# EAGLE design ADC_DSP_DIFF (EAGLE 7.4.0)
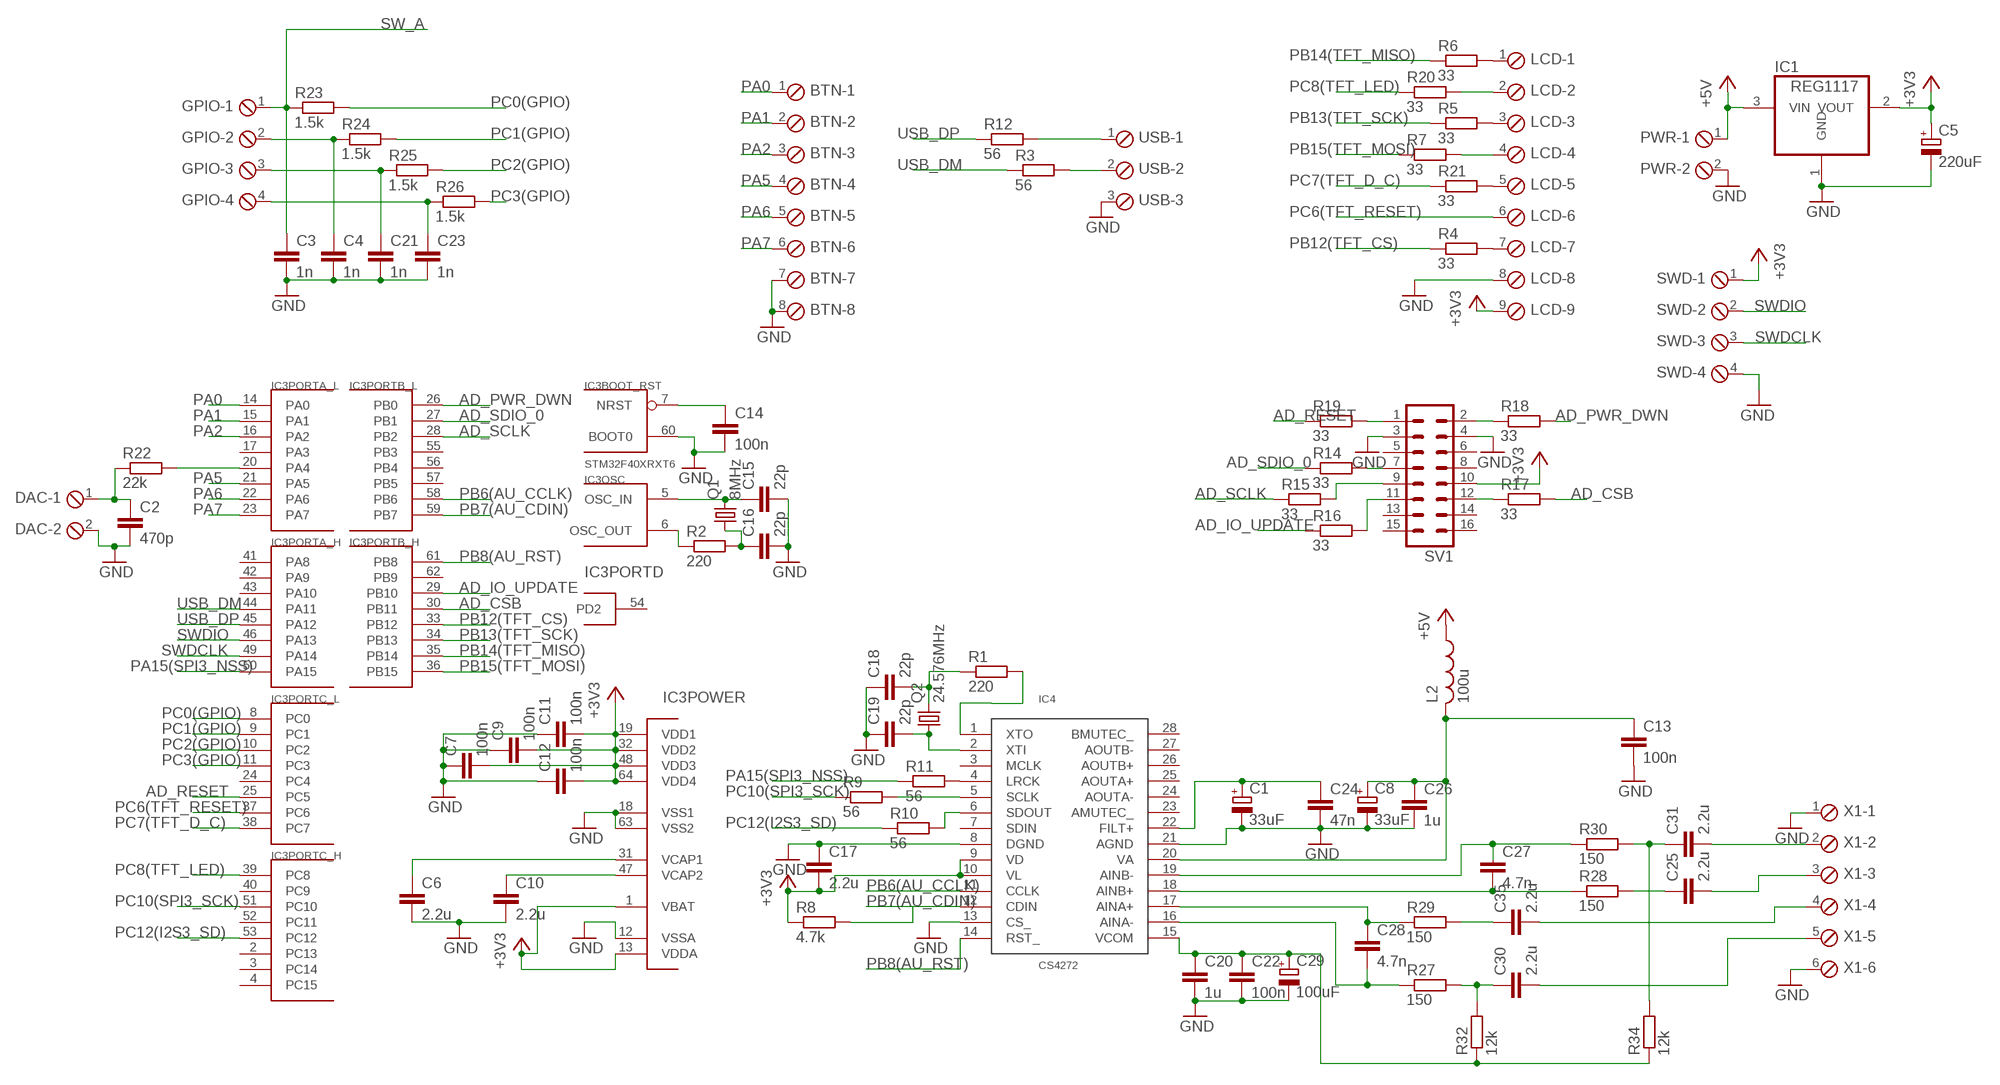
[diagram p0: schematic, sheet 1]

## Parts
BTN  MPT8  [8POL254]
C1  33uF  CPOL-EU153CLV-0605  [153CLV-0605]
C2  470p  C-EUC0805  [C0805]
C3  1n  C-EUC0805  [C0805]
C4  1n  C-EUC0805  [C0805]
C5  220uF  CPOL-EU153CLV-0605  [153CLV-0605]
C6  2.2u  C-EUC0603  [C0603]
C7  100n  C-EUC0603  [C0603]
C8  33uF  CPOL-EU153CLV-0605  [153CLV-0605]
C9  100n  C-EUC0603  [C0603]
C10  2.2u  C-EUC0603  [C0603]
C11  100n  C-EUC0603  [C0603]
C12  100n  C-EUC0603  [C0603]
C13  100n  C-EUC0603  [C0603]
C14  100n  C-EUC0603  [C0603]
C15  22p  C-EUC0603  [C0603]
C16  22p  C-EUC0603  [C0603]
C17  2.2u  C-EUC0603  [C0603]
C18  22p  C-EUC0603  [C0603]
C19  22p  C-EUC0603  [C0603]
C20  1u  C-EUC0603  [C0603]
C21  1n  C-EUC0805  [C0805]
C22  100n  C-EUC0603  [C0603]
C23  1n  C-EUC0805  [C0805]
C24  47n  C-EUC0805  [C0805]
C25  2.2u  C-EUC0805  [C0805]
C26  1u  C-EUC0603  [C0603]
C27  4.7n  C-EUC0805  [C0805]
C28  4.7n  C-EUC0805  [C0805]
C29  100uF  CPOL-EU153CLV-0605  [153CLV-0605]
C30  2.2u  C-EUC0805  [C0805]
C31  2.2u  C-EUC0805  [C0805]
C35  2.2u  C-EUC0805  [C0805]
DAC  MPT2  [2POL254]
GPIO  MPT4  [4POL254]
IC1  REG1117  [SOT223]
IC3  STM32F40XRXT6  [TQFP64]
IC4  CS4272  [TSSOP28]
L2  100u  L-US0207/12  [0207/12]
LCD  MPT9  [9POL254]
PWR  MPT2  [2POL254]
Q1  8MHz  CRYSTALHC49S  [HC49/S]
Q2  24.576MHz  CRYSTALHC49S  [HC49/S]
R1  220  R-EU_R0603  [R0603]
R2  220  R-EU_R0603  [R0603]
R3  56  R-EU_R0603  [R0603]
R4  33  R-EU_R0603  [R0603]
R5  33  R-EU_R0603  [R0603]
R6  33  R-EU_R0603  [R0603]
R7  33  R-EU_R0603  [R0603]
R8  4.7k  R-EU_R0603  [R0603]
R9  56  R-EU_R0603  [R0603]
R10  56  R-EU_R0603  [R0603]
R11  56  R-EU_R0603  [R0603]
R12  56  R-EU_R0603  [R0603]
R14  33  R-EU_R0603  [R0603]
R15  33  R-EU_R0603  [R0603]
R16  33  R-EU_R0603  [R0603]
R17  33  R-EU_R0603  [R0603]
R18  33  R-EU_R0603  [R0603]
R19  33  R-EU_R0603  [R0603]
R20  33  R-EU_R0603  [R0603]
R21  33  R-EU_R0603  [R0603]
R22  22k  R-EU_R0603  [R0603]
R23  1.5k  R-EU_R0603  [R0603]
R24  1.5k  R-EU_R0603  [R0603]
R25  1.5k  R-EU_R0603  [R0603]
R26  1.5k  R-EU_R0603  [R0603]
R27  150  R-EU_R0603  [R0603]
R28  150  R-EU_R0603  [R0603]
R29  150  R-EU_R0603  [R0603]
R30  150  R-EU_R0603  [R0603]
R32  12k  R-EU_R0603  [R0603]
R34  12k  R-EU_R0603  [R0603]
SV1  ML16  [ML16]
SWD  MPT4  [4POL254]
USB  MPT3  [3POL254]
X1  MPT6  [6POL254]

## Nets
4052_B: C4.1 GPIO.2 R24.1
+3V3: C5.+ C7.2 C9.2 C11.2 C12.2 C17.2 IC1.2(VOUT) IC3.1(POWER:VBAT) IC3.13(POWER:VDDA) IC3.19(POWER:VDD1) IC3.32(POWER:VDD2) IC3.48(POWER:VDD3) IC3.64(POWER:VDD4) IC4.9(VD) IC4.10(VL) LCD.9 R8.1 SV1.10 SWD.1
+5V: IC1.3(VIN) L2.1 PWR.1
AD_CSB: IC3.30(PORTB_H:PB11) R17.2
AD_IO_UPDATE: IC3.29(PORTB_H:PB10) R16.1
AD_PWR_DWN: IC3.26(PORTB_L:PB0) R18.2
AD_RESET: IC3.25(PORTC_L:PC5) R19.1
AD_SCLK: IC3.28(PORTB_L:PB2) R15.1
AD_SDIO_0: IC3.27(PORTB_L:PB1) R14.1
AINB+: C27.2 IC4.18(AINB+) R28.1
AVCC: C8.+ C13.1 C26.1 IC4.20(VA) L2.2
D+: R12.2 USB.1
D-: R3.2 USB.2
GND: BTN.7 BTN.8 C1.- C2.2 C3.2 C4.2 C5.- C6.2 C7.1 C8.- C9.1 C10.2 C11.1 C12.1 C13.2 C14.2 C15.2 C16.2 C17.1 C18.1 C19.1 C20.2 C21.2 C22.2 C23.2 C24.2 C26.2 C29.- DAC.2 IC1.1(GND) IC3.12(POWER:VSSA) IC3.18(POWER:VSS1) IC3.60(BOOT_RST:BOOT0) IC3.63(POWER:VSS2) IC4.8(DGND) IC4.13(CS_) IC4.21(AGND) LCD.8 PWR.2 SV1.3 SV1.4 SWD.4 USB.3 X1.1 X1.6
N$1: C10.1 IC3.47(POWER:VCAP2)
N$2: C6.1 IC3.31(POWER:VCAP1)
N$3: R16.2 SV1.11
N$4: C14.1 IC3.7(BOOT_RST:NRST)
N$5: C15.1 IC3.5(OSC:OSC_IN) Q1.2
N$6: C16.1 Q1.1 R2.2
N$7: C19.2 IC4.2(XTI) Q2.1
N$8: C18.2 Q2.2 R1.1
N$9: IC4.4(LRCK) R11.2
N$10: IC4.5(SCLK) R9.2
N$11: IC4.6(SDOUT) R10.2
N$12: C1.+ C24.1 IC4.22(FILT+)
N$13: C27.1 IC4.19(AINB-) R30.1
N$14: R14.2 SV1.7
N$15: C35.2 X1.4
N$16: R19.2 SV1.1
N$17: IC4.1(XTO) R1.2
N$18: C28.1 IC4.17(AINA+) R29.1
N$19: IC3.6(OSC:OSC_OUT) R2.1
N$20: LCD.1 R6.2
N$21: LCD.3 R5.2
N$22: LCD.2 R20.2
N$23: R15.2 SV1.9
N$24: LCD.4 R7.2
N$26: C28.2 IC4.16(AINA-) R27.1
N$29: R18.1 SV1.2
N$30: C31.1 R30.2 R34.2
N$31: R17.1 SV1.12
N$34: LCD.7 R4.2
N$35: LCD.5 R21.2
N$36: IC3.20(PORTA_L:PA4) R22.2
N$37: C2.1 DAC.1 R22.1
N$38: C30.1 R27.2 R32.2
N$39: C25.1 R28.2
N$40: C21.1 GPIO.3 R25.1
N$41: C23.1 GPIO.4 R26.1
N$49: C31.2 X1.2
N$50: C35.1 R29.2
N$51: C25.2 X1.3
N$52: C30.2 X1.5
PA0: BTN.1 IC3.14(PORTA_L:PA0)
PA1: BTN.2 IC3.15(PORTA_L:PA1)
PA2: BTN.3 IC3.16(PORTA_L:PA2)
PA5: BTN.4 IC3.21(PORTA_L:PA5)
PA6: BTN.5 IC3.22(PORTA_L:PA6)
PA7: BTN.6 IC3.23(PORTA_L:PA7)
PA15(SPI3_NSS): IC3.50(PORTA_H:PA15) R11.1
PB6(AU_CCLK): IC3.58(PORTB_L:PB6) IC4.11(CCLK)
PB7(AU_CDIN): IC3.59(PORTB_L:PB7) IC4.12(CDIN) R8.2
PB8(AU_RST): IC3.61(PORTB_H:PB8) IC4.14(RST_)
PB12(TFT_CS): IC3.33(PORTB_H:PB12) R4.1
PB13(TFT_SCK): IC3.34(PORTB_H:PB13) R5.1
PB14(TFT_MISO): IC3.35(PORTB_H:PB14) R6.1
PB15(TFT_MOSI): IC3.36(PORTB_H:PB15) R7.1
PC0(GPIO): IC3.8(PORTC_L:PC0) R23.2
PC1(GPIO): IC3.9(PORTC_L:PC1) R24.2
PC2(GPIO): IC3.10(PORTC_L:PC2) R25.2
PC3(GPIO): IC3.11(PORTC_L:PC3) R26.2
PC6(TFT_RESET): IC3.37(PORTC_L:PC6) LCD.6
PC7(TFT_D_C): IC3.38(PORTC_L:PC7) R21.1
PC8(TFT_LED): IC3.39(PORTC_H:PC8) R20.1
PC10(SPI3_SCK): IC3.51(PORTC_H:PC10) R9.1
PC12(I2S3_SD): IC3.53(PORTC_H:PC12) R10.1
SW_A: C3.1 GPIO.1 R23.1
SWDCLK: IC3.49(PORTA_H:PA14) SWD.3
SWDIO: IC3.46(PORTA_H:PA13) SWD.2
USB_DM: IC3.44(PORTA_H:PA11) R3.1
USB_DP: IC3.45(PORTA_H:PA12) R12.1
VCOM: C20.1 C22.1 C29.+ IC4.15(VCOM) R32.1 R34.1
Unconnected: IC3.2(PORTC_H:PC13) IC3.3(PORTC_H:PC14) IC3.4(PORTC_H:PC15) IC3.17(PORTA_L:PA3) IC3.24(PORTC_L:PC4) IC3.40(PORTC_H:PC9) IC3.41(PORTA_H:PA8) IC3.42(PORTA_H:PA9) IC3.43(PORTA_H:PA10) IC3.52(PORTC_H:PC11) IC3.54(PORTD:PD2) IC3.55(PORTB_L:PB3) IC3.56(PORTB_L:PB4) IC3.57(PORTB_L:PB5) IC3.62(PORTB_H:PB9) IC4.3(MCLK) IC4.7(SDIN) IC4.23(AMUTEC_) IC4.24(AOUTA-) IC4.25(AOUTA+) IC4.26(AOUTB+) IC4.27(AOUTB-) IC4.28(BMUTEC_) SV1.5 SV1.6 SV1.8 SV1.13 SV1.14 SV1.15 SV1.16

## Library data of the parts
BTN = con-phoenix-254:MPT8: PHOENIX CONNECTOR; OC_FARNELL: unknown; OC_NEWARK: unknown
C1 C5 C8 C29 = rcl:CPOL-EU: POLARIZED CAPACITOR, European symbol
C2-C4 C6 C7 C9-C28 C30 C31 C35 = rcl:C-EU: CAPACITOR, European symbol
DAC PWR = con-phoenix-254:MPT2: PHOENIX CONNECTOR; OC_FARNELL: unknown; OC_NEWARK: unknown
GPIO SWD = con-phoenix-254:MPT4: PHOENIX CONNECTOR; OC_FARNELL: unknown; OC_NEWARK: unknown
IC1 = burr-brown:REG1117: 800mA and 1A Low Dropout (LDO) Positive Regulator 1.8V, 2.5V, 2.85V, 3.3V, 5V, and Adj; MPN: REG1117; OC_FARNELL: 1097566; OC_NEWARK: 14P6981
IC3 = stm32:STM32F40XRXT6: STM32F40X LQFP64
IC4 = balmer:CS4272: 24-Bit, 192 kHz Stereo Audio CODEC
L2 = rcl:L-US: INDUCTOR, American symbol
LCD = con-phoenix-254:MPT9: PHOENIX CONNECTOR; OC_FARNELL: unknown; OC_NEWARK: unknown
Q1 Q2 = crystal:CRYSTAL: CRYSTAL; OC_FARNELL: 1667008; OC_NEWARK: unknown
R1-R12 R14-R30 R32 R34 = rcl:R-EU_: RESISTOR, European symbol
SV1 = con-harting-ml:ML16: HARTING; OC_FARNELL: unknown; OC_NEWARK: unknown
USB = con-phoenix-254:MPT3: PHOENIX CONNECTOR; OC_FARNELL: unknown; OC_NEWARK: unknown
X1 = con-phoenix-254:MPT6: PHOENIX CONNECTOR; OC_FARNELL: unknown; OC_NEWARK: unknown

## Board
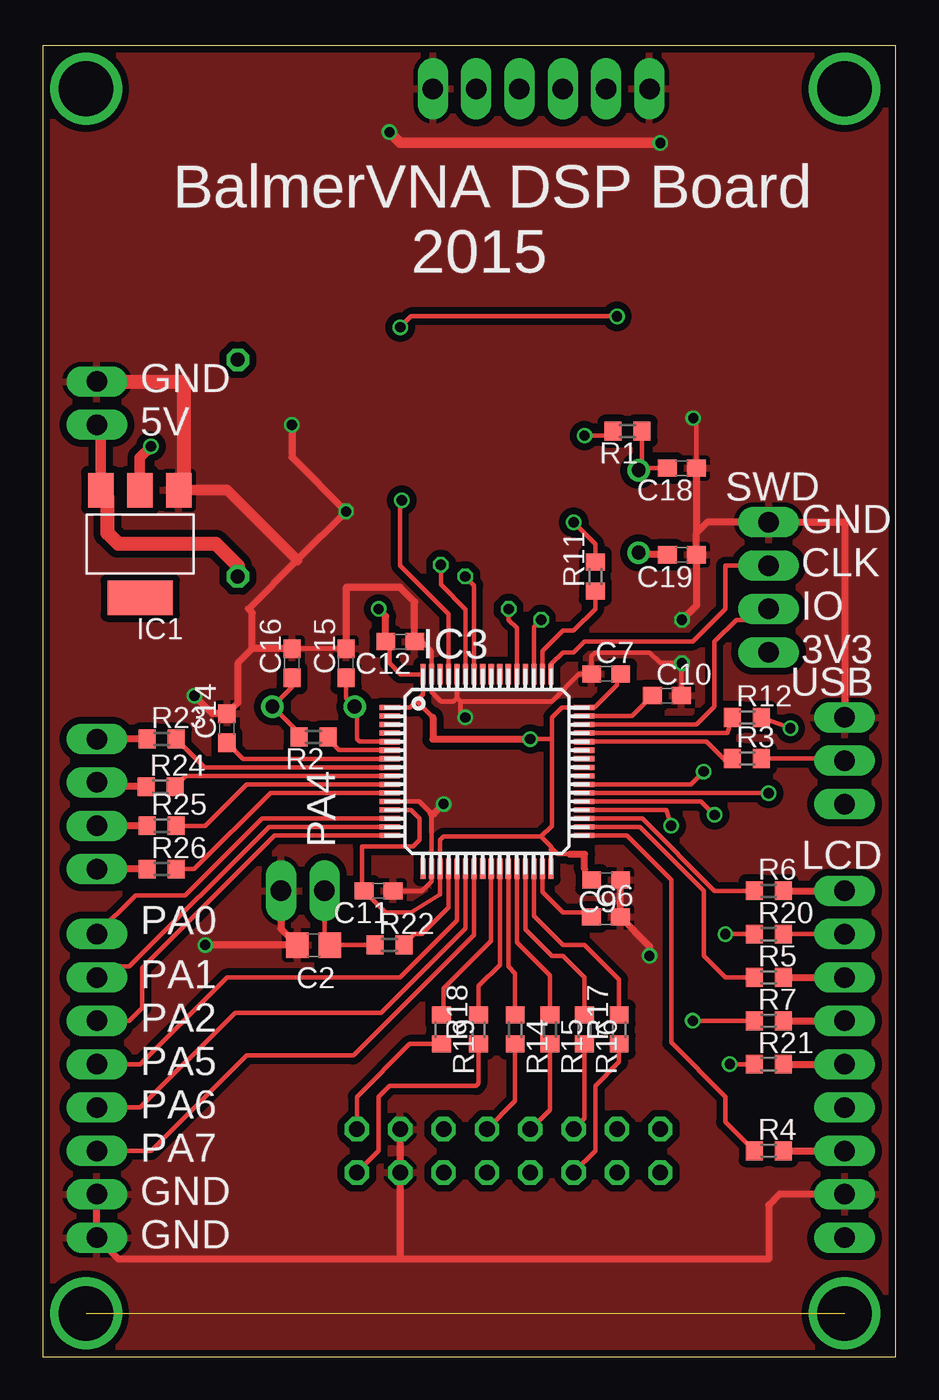
[diagram p1: board, top side]
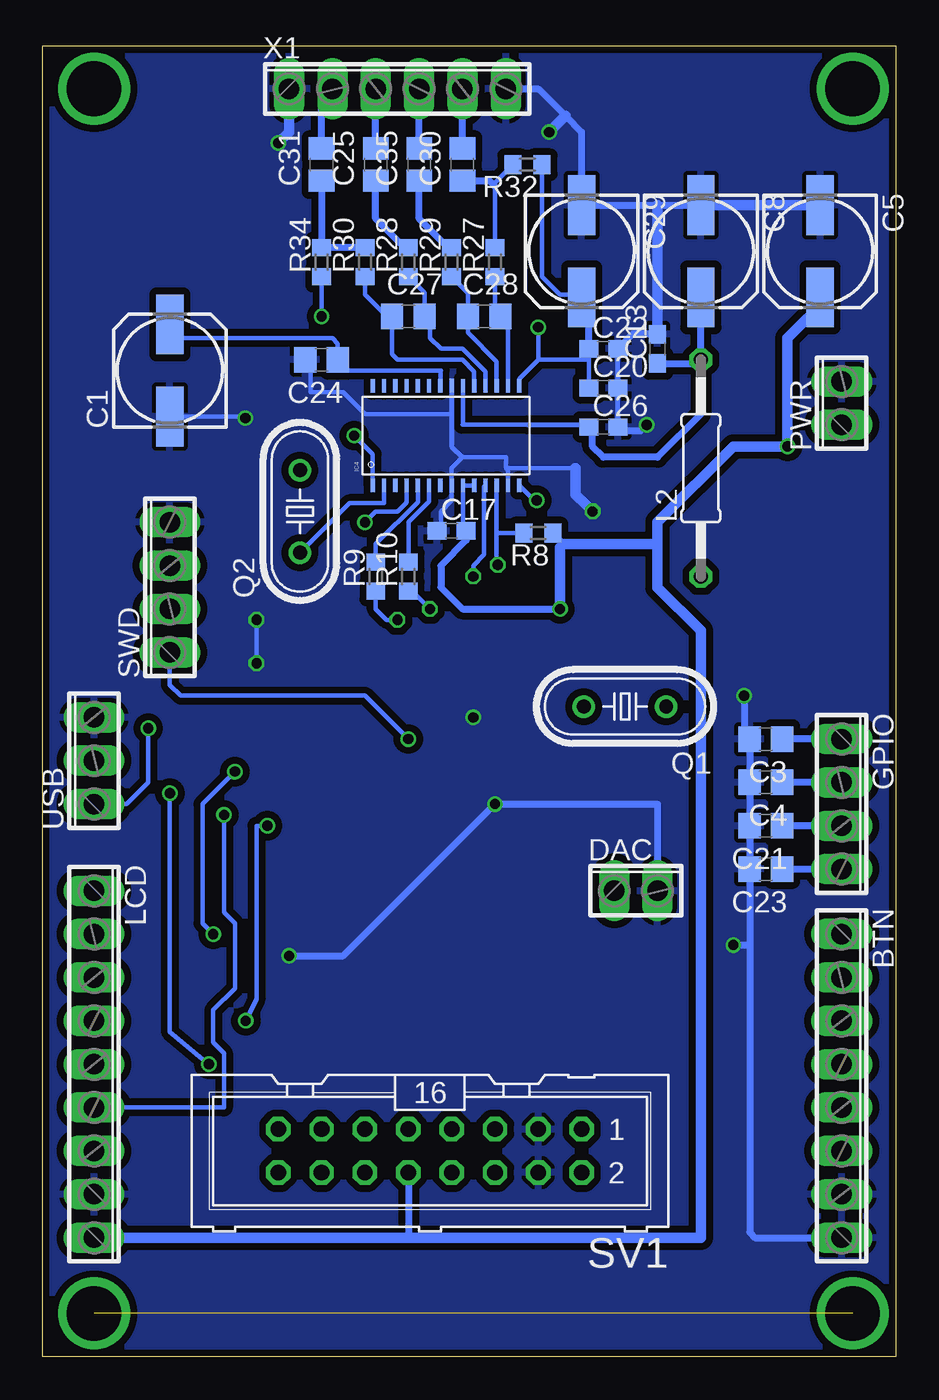
[diagram p2: board, bottom side, seen from below]

Size 50 x 76.83 mm. Coordinates in mm from the lower left corner, seen from the top.
Outline: 0,0 50,0 50,76.83 0,76.83 0,0
Copper layers (1*16): Top 0.035mm / dielectric 1.5mm / Bottom 0.035mm
Design rules "ITEADstudio_DRC": minimum track width 6mil, minimum drill 12mil, track to track 6mil, track to pad 6mil, pad to pad 6mil, via to via 6mil, smd to smd 0mil, copper to edge 10mil, drill to drill 10mil, minimum pad ring 10mil, minimum via ring 6mil, stop-mask expansion 2mil, vias tented up to drill 100mil, thermal gap 10mil

### Footprints (pad centres in the part's own frame; a part is rotated, then mirrored left to right if it is on the bottom)
8POL254 = drill 1.2 long: 1 -8.89,0; 2 -6.35,0; 3 -3.81,0; 4 -1.27,0; 5 1.27,0; 6 3.81,0; 7 6.35,0; 8 8.89,0
153CLV-0605 = smd 3.5 x 1.6: + 2.7,0; - -2.7,0
C0805 = smd 1.3 x 1.5: 1 -0.95,0; 2 0.95,0
C0603 = smd 1.1 x 1: 1 -0.85,0; 2 0.85,0
2POL254 = drill 1.2 long: 1 -1.27,0; 2 1.27,0
4POL254 = drill 1.2 long: 1 -3.81,0; 2 -1.27,0; 3 1.27,0; 4 3.81,0
SOT223 = smd 1.499 x 2.007: 1 -2.261,-3.15; 2 0.025,-3.15; 3 2.311,-3.15 | smd 3.81 x 2.007: 4 0,3.15
TQFP64 = smd 1.2 x 0.3: 1 -5.7,3.75; 2 -5.7,3.25; 3 -5.7,2.75; 4 -5.7,2.25; 5 -5.7,1.75; 6 -5.7,1.25; 7 -5.7,0.75; 8 -5.7,0.25; 9 -5.7,-0.25; 10 -5.7,-0.75; 11 -5.7,-1.25; 12 -5.7,-1.75; 13 -5.7,-2.25; 14 -5.7,-2.75; 15 -5.7,-3.25; 16 -5.7,-3.75; 33 5.7,-3.75; 34 5.7,-3.25; 35 5.7,-2.75; 36 5.7,-2.25; 37 5.7,-1.75; 38 5.7,-1.25; 39 5.7,-0.75; 40 5.7,-0.25; 41 5.7,0.25; 42 5.7,0.75; 43 5.7,1.25; 44 5.7,1.75; 45 5.7,2.25; 46 5.7,2.75; 47 5.7,3.25; 48 5.7,3.75 | smd 0.3 x 1.2: 17 -3.75,-5.7; 18 -3.25,-5.7; 19 -2.75,-5.7; 20 -2.25,-5.7; 21 -1.75,-5.7; 22 -1.25,-5.7; 23 -0.75,-5.7; 24 -0.25,-5.7; 25 0.25,-5.7; 26 0.75,-5.7; 27 1.25,-5.7; 28 1.75,-5.7; 29 2.25,-5.7; 30 2.75,-5.7; 31 3.25,-5.7; 32 3.75,-5.7; 49 3.75,5.7; 50 3.25,5.7; 51 2.75,5.7; 52 2.25,5.7; 53 1.75,5.7; 54 1.25,5.7; 55 0.75,5.7; 56 0.25,5.7; 57 -0.25,5.7; 58 -0.75,5.7; 59 -1.25,5.7; 60 -1.75,5.7; 61 -2.25,5.7; 62 -2.75,5.7; 63 -3.25,5.7; 64 -3.75,5.7
TSSOP28 = smd 0.8 x 0.25: 1 -2.921,4.623; 2 -2.921,3.962; 3 -2.921,3.302; 4 -2.921,2.642; 5 -2.921,1.981; 6 -2.921,1.321; 7 -2.921,0.66; 8 -2.927,0; 9 -2.921,-0.66; 10 -2.921,-1.321; 11 -2.921,-1.981; 12 -2.921,-2.642; 13 -2.921,-3.302; 14 -2.921,-3.962; 15 2.921,-3.962; 16 2.921,-3.302; 17 2.921,-2.642; 18 2.921,-1.981; 19 2.921,-1.321; 20 2.921,-0.66; 21 2.927,0; 22 2.921,0.66; 23 2.921,1.321; 24 2.921,1.981; 25 2.921,2.642; 26 2.921,3.302; 27 2.921,3.962; 28 2.921,4.623
0207/12 = drill 0.813 octagon: 1 -6.35,0; 2 6.35,0
9POL254 = drill 1.2 long: 1 -10.16,0; 2 -7.62,0; 3 -5.08,0; 4 -2.54,0; 5 0,0; 6 2.54,0; 7 5.08,0; 8 7.62,0; 9 10.16,0
HC49/S = drill 0.813: 1 -2.413,0; 2 2.413,0
R0603 = smd 1 x 1.1: 1 -0.85,0; 2 0.85,0
ML16 = drill 0.914 octagon: 1 -8.89,-1.27; 2 -8.89,1.27; 3 -6.35,-1.27; 4 -6.35,1.27; 5 -3.81,-1.27; 6 -3.81,1.27; 7 -1.27,-1.27; 8 -1.27,1.27; 9 1.27,-1.27; 10 1.27,1.27; 11 3.81,-1.27; 12 3.81,1.27; 13 6.35,-1.27; 14 6.35,1.27; 15 8.89,-1.27; 16 8.89,1.27
3POL254 = drill 1.2 long: 1 -2.54,0; 2 0,0; 3 2.54,0
6POL254 = drill 1.2 pad 1.778 long: 1 -6.35,0; 2 -3.81,0; 3 -1.27,0; 4 1.27,0; 5 3.81,0; 6 6.35,0

### Placement (x,y rotation side)
BTN  3.17,15.88 270 bottom
C1  42.55,57.78 90 bottom
C2  15.88,24.13 180 top
C3  7.62,36.2 180 bottom
C4  7.62,33.66 180 bottom
C5  4.45,64.77 270 bottom
C6  33,25.77 0 top
C7  33.02,40.01 0 top
C8  11.43,64.77 270 bottom
C9  33.02,27.94 180 top
C10  36.58,38.73 0 top
C11  19.68,27.3 180 top
C12  20.95,41.91 180 top
C13  13.97,59.05 90 bottom
C14  10.79,36.83 90 top
C15  17.78,40.64 90 top
C16  14.61,40.64 90 top
C17  26.04,48.4 0 bottom
C18  37.47,52.07 180 top
C19  37.47,46.99 180 top
C20  17.14,56.77 0 bottom
C21  7.62,31.11 180 bottom
C22  17.14,59.05 0 bottom
C23  7.62,28.57 180 bottom
C24  33.66,58.42 180 bottom
C25  30.48,69.85 90 bottom
C26  17.14,54.48 0 bottom
C27  28.57,60.96 0 bottom
C28  24.13,60.96 0 bottom
C29  18.41,64.77 270 bottom
C30  25.4,69.85 90 bottom
C31  33.66,69.85 90 bottom
C35  27.94,69.85 90 bottom
DAC  15.24,27.3 0 bottom
GPIO  3.17,32.38 270 bottom
IC1  5.71,47.62 180 top
IC3  26.04,34.29 0 top
IC4  26.04,53.98 90 bottom
L2  11.43,52.07 90 bottom
LCD  46.99,17.14 270 bottom
PWR  3.17,55.88 90 bottom
Q1  15.88,38.1 180 bottom
Q2  34.92,49.53 90 bottom
R1  34.27,54.23 180 top
R2  15.88,36.32 180 top
R3  41.27,35.06 0 top
R4  42.55,12.06 0 top
R5  42.55,22.23 0 top
R6  42.55,27.3 0 top
R7  42.55,19.68 0 top
R8  20.95,48.26 180 bottom
R9  30.48,45.72 90 bottom
R10  28.57,45.72 90 bottom
R11  32.38,45.72 90 top
R12  41.27,37.47 0 top
R14  27.69,19.18 270 top
R15  29.72,19.18 270 top
R16  31.75,19.18 270 top
R17  33.78,19.18 90 top
R18  25.54,19.18 90 top
R19  23.38,19.18 270 top
R20  42.55,24.77 0 top
R21  42.55,17.14 0 top
R22  20.32,24.13 0 top
R23  6.99,36.2 0 top
R24  6.91,33.41 0 top
R25  6.99,31.11 0 top
R26  6.99,28.57 0 top
R27  23.5,64.14 90 bottom
R28  28.57,64.14 90 bottom
R29  26.04,64.14 90 bottom
R30  31.11,64.14 90 bottom
R32  21.59,69.85 180 bottom
R34  33.66,64.14 90 bottom
SV1  27.3,12.06 180 bottom
SWD  42.55,45.09 90 bottom
USB  46.99,34.92 90 bottom
X1  29.21,74.3 0 bottom

### Tracks (layer width: path | path; a pad name or v marks a point on that pad's centre or on a via)
4052_B
  Top 0.406: R24.1 3.42,33.41 GPIO.2
  Bottom 0.406: GPIO.2 C4.1
+3V3  (via drill 0.6)
  Top 0.25: 29.21,30.48 23.5,30.48 23.29,30.27 IC3.19 23.29,27.09 21.59,26.04 20.11,26.04 C11.2 | IC3.32 29.79,29.84 | 29.79,29.84 29.79,29.91 29.21,30.48 | 29.84,36.2 29.84,37.47 30.42,38.04 IC3.48 32.33,38.04 33.66,39.37 33.66,39.79 C7.2 | 29.84,36.2 29.84,31.11 29.21,30.48 | C12.2 20.32,41.7 20.32,40.64 20.97,39.99 IC3.64 22.29,38.8 21.91,38.42 | IC3.1 21.53,38.04 21.91,38.42 | 22.86,37.47 21.91,38.42 | 29.79,29.84 30.18,29.45 30.88,29.45 | 31.75,28.57 31.75,28.36 C9.2 | IC3.13 21.58,32.04 22.09,31.53 22.09,30.28 21.71,29.91 18.71,29.91 18.71,27.43 C11.2 | 19.05,27.52 C11.2 | v28.57,36.2 29.84,36.2
  Top 0.406: 30.88,29.45 31.75,29.45 31.75,28.57 | C12.2 20.11,43.4 v19.68,43.81 | 22.86,37.47 22.86,36.2 v28.57,36.2
  Top 0.61: IC1.2 5.69,52.68 v6.35,53.34
  Bottom 0.25: IC4.10 IC4.9 25.38,48.59 C17.2 | SWD.1 42.55,39.37 41.91,38.73 31.11,38.73 v28.57,36.2
  Bottom 0.406: R8.1 19.47,47.62 19.68,47.41 | C17.2 25.18,47.84 26.67,46.35 26.67,45.09 25.4,43.81 v19.68,43.81 | SV1.10 28.57,6.99
  Bottom 0.61: v19.68,43.81 19.68,47.41 | 13.97,47.62 19.47,47.62 | C5.+ 3.97,62.07 6.35,59.69 v6.35,53.34 9.53,53.34 13.97,48.9 13.97,47.62 | LCD.9 28.57,6.99 11.43,6.99 11.43,42.55 13.97,45.09 13.97,47.62
+5V
  Top 0.61: IC1.3 3.4,54.38 PWR.1
  Top 0.813: L2.1 11.43,46.35 10.16,47.62 4.45,47.62 3.81,48.26 3.81,50.37 IC1.3
AD_CSB
  Top 0.25: IC3.30 28.79,25.82 30.48,24.13 31.75,24.13 33.78,22.1 R17.2
AD_IO_UPDATE
  Top 0.25: IC3.29 28.29,25.05 29.84,23.5 30.48,23.5 31.75,22.23 R16.1
AD_PWR_DWN
  Top 0.25: IC3.26 26.79,22.98 25.54,21.73 R18.2
AD_RESET
  Top 0.25: IC3.25 26.29,24.38 23.5,21.59 23.5,20.14 R19.1
AD_SCLK
  Top 0.25: IC3.28 27.79,24.29 29.72,22.35 R15.1
AD_SDIO_0
  Top 0.25: IC3.27 27.29,22.88 27.69,22.48 R14.1
AINB+
  Bottom 0.254: IC4.18 24.05,57.71 25.4,59.05 26.67,59.05 27.3,59.69 27.3,60.64 C27.2 27.62,62.34 R28.1
AVCC
  Bottom 0.25: IC4.20 25.38,54.63 25.4,54.61 21.59,54.61
  Bottom 0.305: 21.59,54.61 18.13,54.61 C26.1
  Bottom 0.406: C8.+ L2.2 11.43,57.78 | 11.43,57.78 11.43,55.24 13.97,52.7 17.14,52.7 17.78,53.34 17.78,54.26 C26.1 | C13.1 11.85,58.2 11.43,57.78
D+  (via drill 0.6)
  Top 0.25: R12.2 v43.81,36.83
  Bottom 0.25: v43.81,36.83 43.81,33.66 45.09,32.38 USB.1
D-
  Top 0.25: R3.2 46.85,35.06 USB.2
GND  (via drill 0.6)
  Top 0.25: C12.1 22.23,41.91 22.79,41.35 IC3.63 22.79,38.95 23.34,38.4 24.09,38.4 24.29,38.6 | IC3.60 24.29,38.6 | 24.29,38.6 24.48,38.4 29.84,38.4 31.44,40.01 C7.1 32.17,41.06 32.38,41.27 35.56,41.27 36.2,40.64 v37.47,40.64 37.43,40.6 C10.2 | C15.2 C16.2 | C11.1 22.23,27.3 22.79,27.86 IC3.18 22.79,31.82 22.07,32.54 IC3.12 | C18.1 38.31,54.81 v38.12,55
  Top 0.254: 24.48,38.4 24.48,37.74 v24.77,37.47
  Top 0.406: C16.2 12.28,41.49 | 12.28,41.49 11.43,40.64 11.43,38.31 C14.2 9.95,37.68 v8.89,38.73 | BTN.7 BTN.8 4.45,5.71 20.95,5.71 | v35.56,23.5 35.56,24.05 C6.2 33.85,27.92 C9.1 | v37.47,43.18 38.31,44.03 C19.1 38.31,48.26 | USB.3 46.99,48.9 SWD.4 38.95,48.9 38.31,48.26 | 12.28,41.49 12.28,43.6 12.06,43.81 14.92,46.67 v17.78,49.53 14.61,52.7 v14.61,54.61 | C12.1 21.8,44.23 20.95,45.09 17.78,45.09 C15.2 | v9.53,24.13 C2.2 13.97,25.09 DAC.2 | LCD.8 43.18,9.53 42.55,8.89 42.55,5.71 20.95,5.71 | SV1.3 SV1.4 20.95,5.71 | 22.79,31.82 22.93,31.82 v23.5,32.38 | C18.1 38.31,48.26
  Top 0.61: IC1.1 10.82,50.77 14.92,46.67 | v36.2,71.12 20.95,71.12 v20.32,71.75
  Top 0.813: PWR.2 8.26,57.15 8.26,51.05 IC1.1
  Bottom 0.25: C17.1 26.67,48.61 26.67,49.53 26.04,50.16 IC4.8 26.04,52.07 25.4,52.7 22.86,52.7 22.86,52.07 | v37.47,40.64 v37.47,43.18 | 18.78,52.07 22.86,52.07 | IC4.13 22.73,51.94 22.86,52.07 | C24.2 34.29,58.42 34.29,56.52 32.38,56.52 31.11,55.24 26.04,55.24 | C1.- 38.21,55.09 v38.12,55
  Bottom 0.305: IC4.21 26.04,55.24 26.04,53.34 25.4,52.7 | C22.2 C20.2 C26.2 16.51,54.26
  Bottom 0.406: 18.14,49.9 v17.78,49.53 | 16.51,54.26 14.96,54.26 v14.61,54.61 | C8.- 13.97,67.47 C29.- 18.41,71.75 19.37,72.71 20.95,74.3 X1.6 | C13.2 15.45,59.91 C22.2 | 8.57,24.13 C23.2 C21.2 C4.2 C3.2 8.89,36.52 v8.89,38.73 | 8.57,24.13 8.57,7.3 8.26,6.99 BTN.8 | v9.53,24.13 8.57,24.13 | DAC.2 13.97,32.38 v23.5,32.38 32.38,23.5 v35.56,23.5
  Bottom 0.61: 18.78,52.07 18.78,50.53 18.14,49.9 | C8.- C5.- | C13.2 13.97,67.47 | X1.1 35.56,71.75 v36.2,71.12 | v20.32,71.75 19.37,72.71
  pour Bottom (isolate 0.406): 0,77.47 50,77.47 50,0 0,0
  pour Top (isolate 0.406): 0,77.47 50,77.47 50,0 0,0
N$1
  Top 0.25: IC3.47 34.53,37.54 C10.1
N$2
  Top 0.25: IC3.31 29.29,27.23 30.48,26.04 31.88,26.04 C6.1
N$3
  Top 0.25: R16.2 31.75,13.97 SV1.11
N$4
  Top 0.25: C14.1 11.73,35.04 IC3.7
N$5
  Top 0.25: IC3.5 18.57,36.04 18.41,36.2 18.41,37.97 Q1.2 17.78,38.61 C15.1
N$6
  Top 0.25: C16.1 14.61,39.24 Q1.1 15.03,36.54 R2.2
N$7
  Top 0.406: C19.2 35.05,46.99 Q2.1
  Bottom 0.25: IC4.2 30,50.01 32.03,50.01 Q2.1
N$8
  Top 0.25: C18.2 35.05,52.07 Q2.2 35.12,52.14 R1.1
N$9  (via drill 0.6)
  Top 0.25: v31.11,48.9 32.38,47.62 R11.2
  Bottom 0.25: IC4.4 28.68,50.06 29.21,49.53 30.48,49.53 v31.11,48.9
N$10
  Bottom 0.25: IC4.5 28.02,50.09 30.48,47.62 R9.2 30.34,46.72
N$11
  Bottom 0.25: IC4.6 27.36,50.11 28.57,48.9 R10.2
N$12
  Bottom 0.25: IC4.22 26.7,57.76 26.67,57.78 32.07,57.78 C24.1
  Bottom 0.254: C24.1 32.7,59.38 33.02,59.69 41.75,59.69 C1.+
N$13
  Bottom 0.254: IC4.19 24.71,57.73 25.4,58.42 29.21,58.42 29.52,58.73 C27.1 29.84,60.96 31.11,62.23 R30.1
N$14
  Top 0.25: R14.2 27.69,14.99 SV1.7
N$15
  Bottom 0.406: C35.2 X1.4
N$16
  Top 0.25: R19.2 21.5,18.32 18.41,15.24 SV1.1
N$17  (via drill 0.6)
  Top 0.25: v31.75,53.98 33.16,53.98 R1.2
  Bottom 0.25: IC4.1 30.66,52.88 v31.75,53.98
N$18
  Bottom 0.254: IC4.17 23.39,58.32 25.08,60.01 C28.1 25.08,62.33 R29.1
N$19
  Top 0.25: IC3.6 17.38,35.54 16.73,36.2 R2.1
N$20
  Top 0.406: R6.2 LCD.1
N$21
  Top 0.406: R5.2 LCD.3
N$22
  Top 0.25: R20.2 LCD.2
N$23
  Top 0.25: R15.2 29.72,14.48 SV1.9
N$24
  Top 0.406: R7.2 LCD.4
N$26
  Bottom 0.254: IC4.16 22.73,60.51 C28.2 23.5,61.27 R27.1
N$29
  Top 0.25: R18.1 25.54,16.01 25.4,15.88 20.32,15.88 19.68,15.24 19.68,12.06 SV1.2
N$30
  Bottom 0.406: C31.1 R34.2 R30.2
N$31
  Top 0.25: R17.1 33.78,17.27 32.38,15.88 32.38,12.06 SV1.12
N$32  (via drill 3.2)
  other vias: 2.54,74.3
N$33  (via drill 3.2)
  other vias: 46.99,74.3
N$34
  Top 0.406: R4.2 LCD.7
N$35
  Top 0.406: R21.2 LCD.5
N$36
  Top 0.25: IC3.20 23.79,26.32 22.23,24.77 21.8,24.77 R22.2
N$37
  Top 0.25: R22.1 C2.1 16.51,24.45 DAC.1
N$38
  Bottom 0.254: R27.2 23.5,68.58 23.5,68.8 R32.2
  Bottom 0.406: C30.1 23.82,68.9 23.5,68.58
N$39
  Bottom 0.406: R28.2 28.79,64.98 30.48,66.67 C25.1
N$40
  Top 0.406: R25.1 GPIO.3
  Bottom 0.406: GPIO.3 C21.1
N$41
  Top 0.406: R26.1 GPIO.4
  Bottom 0.406: C23.1 GPIO.4
N$48  (via drill 3.2)  (1 unrouted)
  other vias: 46.99,2.54 2.54,2.54
N$49
  Bottom 0.406: C31.2 33.66,73.66 X1.2
N$50
  Bottom 0.406: R29.2 26.25,64.98 27.94,66.67 C35.1
N$51
  Bottom 0.406: C25.2 X1.3
N$52
  Bottom 0.406: C30.2 X1.5
PA0
  Top 0.25: IC3.14 12.85,31.54 8.34,27.03 5.44,27.03 BTN.1
PA1
  Top 0.25: IC3.15 13.26,31.04 5.08,22.86 3.81,22.86 BTN.2
PA2
  Top 0.25: IC3.16 13.6,30.54 5.84,22.78 5.84,20.45 5.08,19.68 BTN.3
PA5
  Top 0.25: IC3.21 24.29,25.55 20.95,22.23 10.79,22.23 5.71,17.14 BTN.4
PA6
  Top 0.25: IC3.22 24.79,25.1 19.84,20.16 11.27,20.16 5.71,14.61 BTN.5
PA7
  Top 0.25: IC3.23 25.29,24.73 18.21,17.66 11.94,17.66 6.35,12.06 BTN.6
PA15(SPI3_NSS)
  Top 0.25: IC3.50 29.29,41.35 30.48,42.55 31.11,42.55 32.38,43.81 R11.1
PB6(AU_CCLK)  (via drill 0.6)
  Top 0.25: IC3.58 25.29,45.2 v24.77,45.72
  Bottom 0.25: v24.77,45.72 24.77,46.35 24.13,46.99 24.13,50.98 IC4.11
PB7(AU_CDIN)  (via drill 0.6)
  Top 0.25: IC3.59 24.79,43.8 23.34,45.24 v23.34,46.4
  Bottom 0.25: IC4.12 23.39,48.26 | 23.39,48.26 23.39,46.46 v23.34,46.4 | R8.2 23.39,48.26
PB8(AU_RST)  (via drill 0.6)
  Top 0.25: IC3.61 23.79,43.52 20.95,46.35 20.95,50.09 v21.05,50.17
  Bottom 0.25: v21.05,50.17 21.19,50.17 IC4.14
PB12(TFT_CS)
  Top 0.25: IC3.33 34.23,30.54 36.83,27.94 36.83,18.41 40.01,15.24 40.01,13.76 R4.1
PB13(TFT_SCK)
  Top 0.25: IC3.34 35,31.04 38.73,27.3 38.73,23.5 40.01,22.23 R5.1
PB14(TFT_MISO)
  Top 0.25: IC3.35 35.13,31.54 39.37,27.3 R6.1
PB15(TFT_MOSI)  (via drill 0.6)
  Top 0.25: IC3.36 36.54,32.04 v36.83,31.11 | v38.1,19.68 R7.1
  Bottom 0.25: v36.83,31.11 37.47,31.11 37.47,20.95 v38.1,19.68
PC0(GPIO)
  Top 0.25: IC3.8 9.49,34.54 R23.2
PC1(GPIO)
  Top 0.25: IC3.9 8.39,34.04 R24.2
PC2(GPIO)
  Top 0.25: IC3.10 11.95,33.54 9.53,31.11 R25.2
PC3(GPIO)
  Top 0.25: IC3.11 13.36,33.04 8.89,28.57 R26.2
PC6(TFT_RESET)  (via drill 0.6)
  Top 0.25: IC3.37 38.58,32.54 v39.37,31.75
  Bottom 0.25: v39.37,31.75 39.37,26.04 38.73,25.4 38.73,21.59 40.01,20.32 40.01,18.41 39.37,17.78 39.37,14.61 LCD.6
PC7(TFT_D_C)  (via drill 0.6)
  Top 0.25: IC3.38 42.52,33.04 v42.55,33.02 | v40.27,17.14 R21.1
  Bottom 0.25: v42.55,33.02 42.55,19.05 v40.27,17.14
PC8(TFT_LED)  (via drill 0.6)
  Top 0.25: IC3.39 37.98,33.54 v38.73,34.29 | v40.01,24.77 R20.1
  Bottom 0.25: v38.73,34.29 40.64,32.38 40.64,25.4 v40.01,24.77
PC10(SPI3_SCK)  (via drill 0.6)
  Top 0.25: IC3.51 28.79,42.76 v29.21,43.18
  Bottom 0.25: v29.21,43.18 29.84,43.18 30.48,43.81 R9.1
PC12(I2S3_SD)  (via drill 0.6)
  Top 0.25: v27.3,43.81 27.3,43.18 27.79,42.7 IC3.53
  Bottom 0.25: R10.1 28.36,44.87 v27.3,43.81
SW_A
  Top 0.406: R23.1 GPIO.1
  Bottom 0.406: GPIO.1 C3.1
SWDCLK
  Top 0.25: IC3.49 29.79,40.58 30.48,41.27 31.11,41.27 31.75,41.91 38.1,41.91 40.01,43.81 40.01,46.35 SWD.3
SWDIO
  Top 0.25: IC3.46 38.31,37.04 39.37,38.1 39.37,41.91 40.64,43.18 41.91,43.18 SWD.2
USB_DM
  Top 0.25: IC3.44 38.89,36.04 40.01,34.92 40.29,34.92 R3.1
USB_DP
  Top 0.25: IC3.45 40.13,36.54 R12.1
VCOM  (via drill 0.6)
  Top 0.254: v33.66,60.96 21.59,60.96 v20.95,60.33
  Bottom 0.25: C20.1 18,58.42 | 18,58.42 C22.1 | IC4.15 22.07,57.3 21.27,58.1 | 20.95,58.42 18,58.42
  Bottom 0.254: R32.1 20.74,63.28 19.68,62.23 18.57,62.23 C29.+ | R34.1 v33.66,60.96 | v20.95,60.33 20.95,58.42 21.27,58.1
  Bottom 0.406: C22.1 18,61.65 C29.+

### Text on the board
_tsilk: BalmerVNA DSP Board | 2015 | GND | 5V | SWD | GND | CLK | IO | 3V3 | USB | PA4 | LCD | PA0 | PA1 | PA2 | PA5 | PA6 | PA7 | GND | GND